# Altium schematic sheet CAN_TERM_LEFT.SchDoc
size A4; SheetNumber: 2; SheetTotal: 3
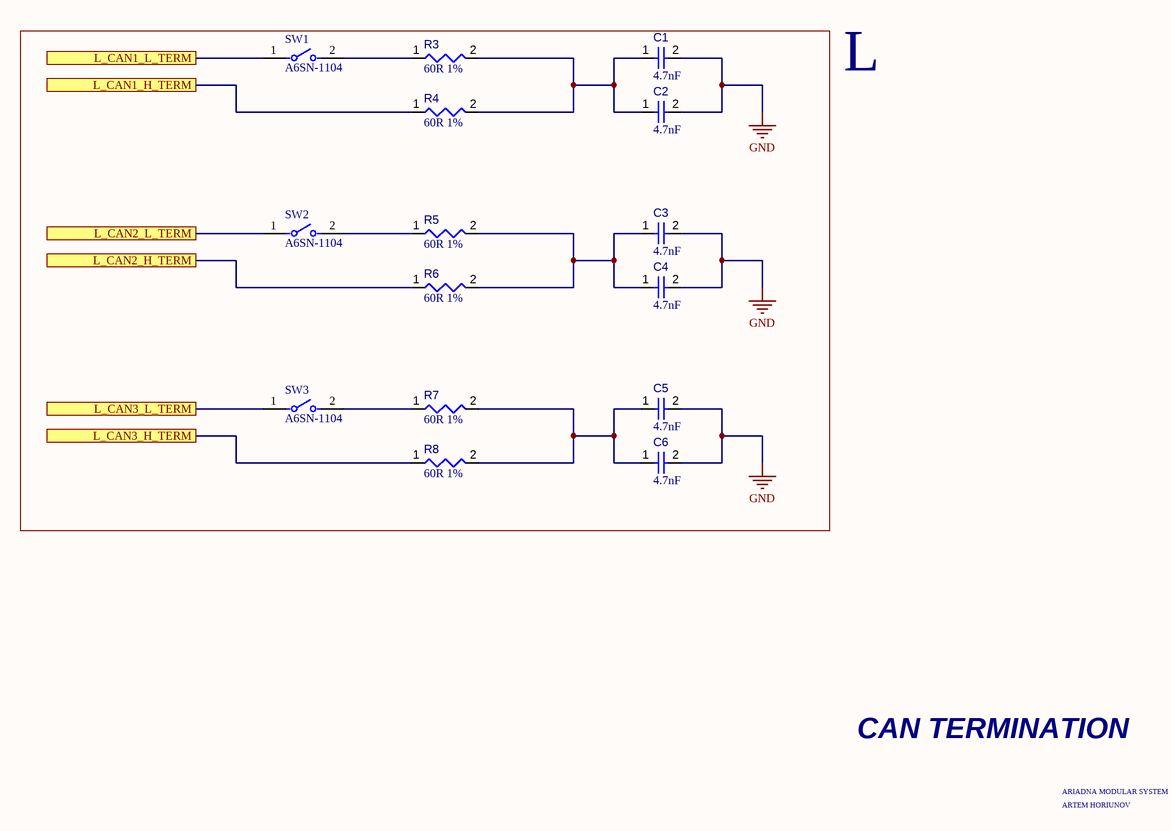
[diagram p0: CAN_TERM_LEFT.SchDoc]

## Parts
C1  value 4.7nF  [CAPC0805(2012)145_L]  (hidden comment: Capacitor 4.7µF +/-40% 25V 0805)
C2  value 4.7nF  [CAPC0805(2012)145_L]  (hidden comment: Capacitor 4.7µF +/-40% 25V 0805)
C3  value 4.7nF  [CAPC0805(2012)145_L]  (hidden comment: Capacitor 4.7µF +/-40% 25V 0805)
C4  value 4.7nF  [CAPC0805(2012)145_L]  (hidden comment: Capacitor 4.7µF +/-40% 25V 0805)
C5  value 4.7nF  [CAPC0805(2012)145_L]  (hidden comment: Capacitor 4.7µF +/-40% 25V 0805)
C6  value 4.7nF  [CAPC0805(2012)145_L]  (hidden comment: Capacitor 4.7µF +/-40% 25V 0805)
R3  value 60R 1%  [RESC0805(2012)_L]  (hidden comment: 4D7R5J)
R4  value 60R 1%  [RESC0805(2012)_L]  (hidden comment: 4D7R5J)
R5  value 60R 1%  [RESC0805(2012)_L]  (hidden comment: 4D7R5J)
R6  value 60R 1%  [RESC0805(2012)_L]  (hidden comment: 4D7R5J)
R7  value 60R 1%  [RESC0805(2012)_L]  (hidden comment: 4D7R5J)
R8  value 60R 1%  [RESC0805(2012)_L]  (hidden comment: 4D7R5J)
SW1  A6SN-1104  [FP-A6SN-1104-MFG]
SW2  A6SN-1104  [FP-A6SN-1104-MFG]
SW3  A6SN-1104  [FP-A6SN-1104-MFG]

## Ports
L_CAN1_H_TERM, L_CAN1_L_TERM, L_CAN2_H_TERM, L_CAN2_L_TERM, L_CAN3_H_TERM, L_CAN3_L_TERM

## Nets
GND: C1.2 C2.2 C3.2 C4.2 C5.2 C6.2
L_CAN1_H_TERM: R4.1 ; port L_CAN1_H_TERM
L_CAN1_L_TERM: SW1.1 ; port L_CAN1_L_TERM
L_CAN2_H_TERM: R6.1 ; port L_CAN2_H_TERM
L_CAN2_L_TERM: SW2.1 ; port L_CAN2_L_TERM
L_CAN3_H_TERM: R8.1 ; port L_CAN3_H_TERM
L_CAN3_L_TERM: SW3.1 ; port L_CAN3_L_TERM
NetC1_1: C1.1 C2.1 R3.2 R4.2
NetC3_1: C3.1 C4.1 R5.2 R6.2
NetC5_1: C5.1 C6.1 R7.2 R8.2
NetR3_1: R3.1 SW1.2
NetR5_1: R5.1 SW2.2
NetR7_1: R7.1 SW3.2

## Notes on the sheet
- L
- CAN TERMINATION
- ARIADNA MODULAR SYSTEM
- ARTEM HORIUNOV

## Library data of the parts
C1-C6 = CMP-001-00080-4: Chip Capacitor, 4.7µF +/-40%, 25V, 0805, Thickness 1.45 mm; Tolerance: 20%; Voltage Rating: 25V; Min Operating Temperature: -55°C; Max Operating Temperature: 85°C; Pins: 2; Mounting Technology: SMT; Case/Package: 0805
R3-R8 = CMP-009-00106-2: 4R7 0.125W 5% 0805 (2012 Metric)  SMD; Power: 125mW; Mounting Technology: SMT; Pins: 2; Case/Package: 0805; Tolerance: 5%
SW1-SW3 = CMP-08827-000077-1: SWITCH SLIDE DIP SPST 25MA 24V; Washable: Yes; Actuator Length: 1mm; Number of Positions: 1; Voltage Rating (DC): 3.5V; Contact Resistance: 200mR; Actuator Type: Standard; Current Rating: 10uA; Electrical Life: 1000Cycles; Orientation: Straight; Series: A6SN; Min Operating Temperature: -30°C; RoHS Compliant: Yes; Max Current Rating: 25mA; Max Operating Temperature: 85°C; Mount: Surface Mount; Number of Circuits: 1; Throw Configuration: SPST; Max Voltage Rating (DC): 24V; Radiation Hardening: No; Termination: Gull Wing; Package Quantity: 100; Packaging: Rail/Tube